# Altium schematic sheet 37. PCIe_INTERFACE 4L.SchDoc: PCIe x4 Card Connector
size 513 x 386 mm; Project: PROC154E2(001)_SK_AM69; Issue: 1.0; RevCode: E3; Page Create Date: March  8, 1995; Variant Name: Core Design; Schematic Page Number: 37; Page Number: 37; Page Size: C; Comment: MISTRAL_TITLEBLK_CSIZE_1; Page Count: 62; Schematic Page Count: 62; Name: PROC154E2 001 SK AM69; DsnPath: C:\Users\danie\Downloads\sprr466c\PROC154E3_RP\PROC154E3_SCH.DSN; SchematicName: SCHEMATIC1; PageName: 37. PCIe_INTERFACE 4L; PageSize: C; TopSchematic: True
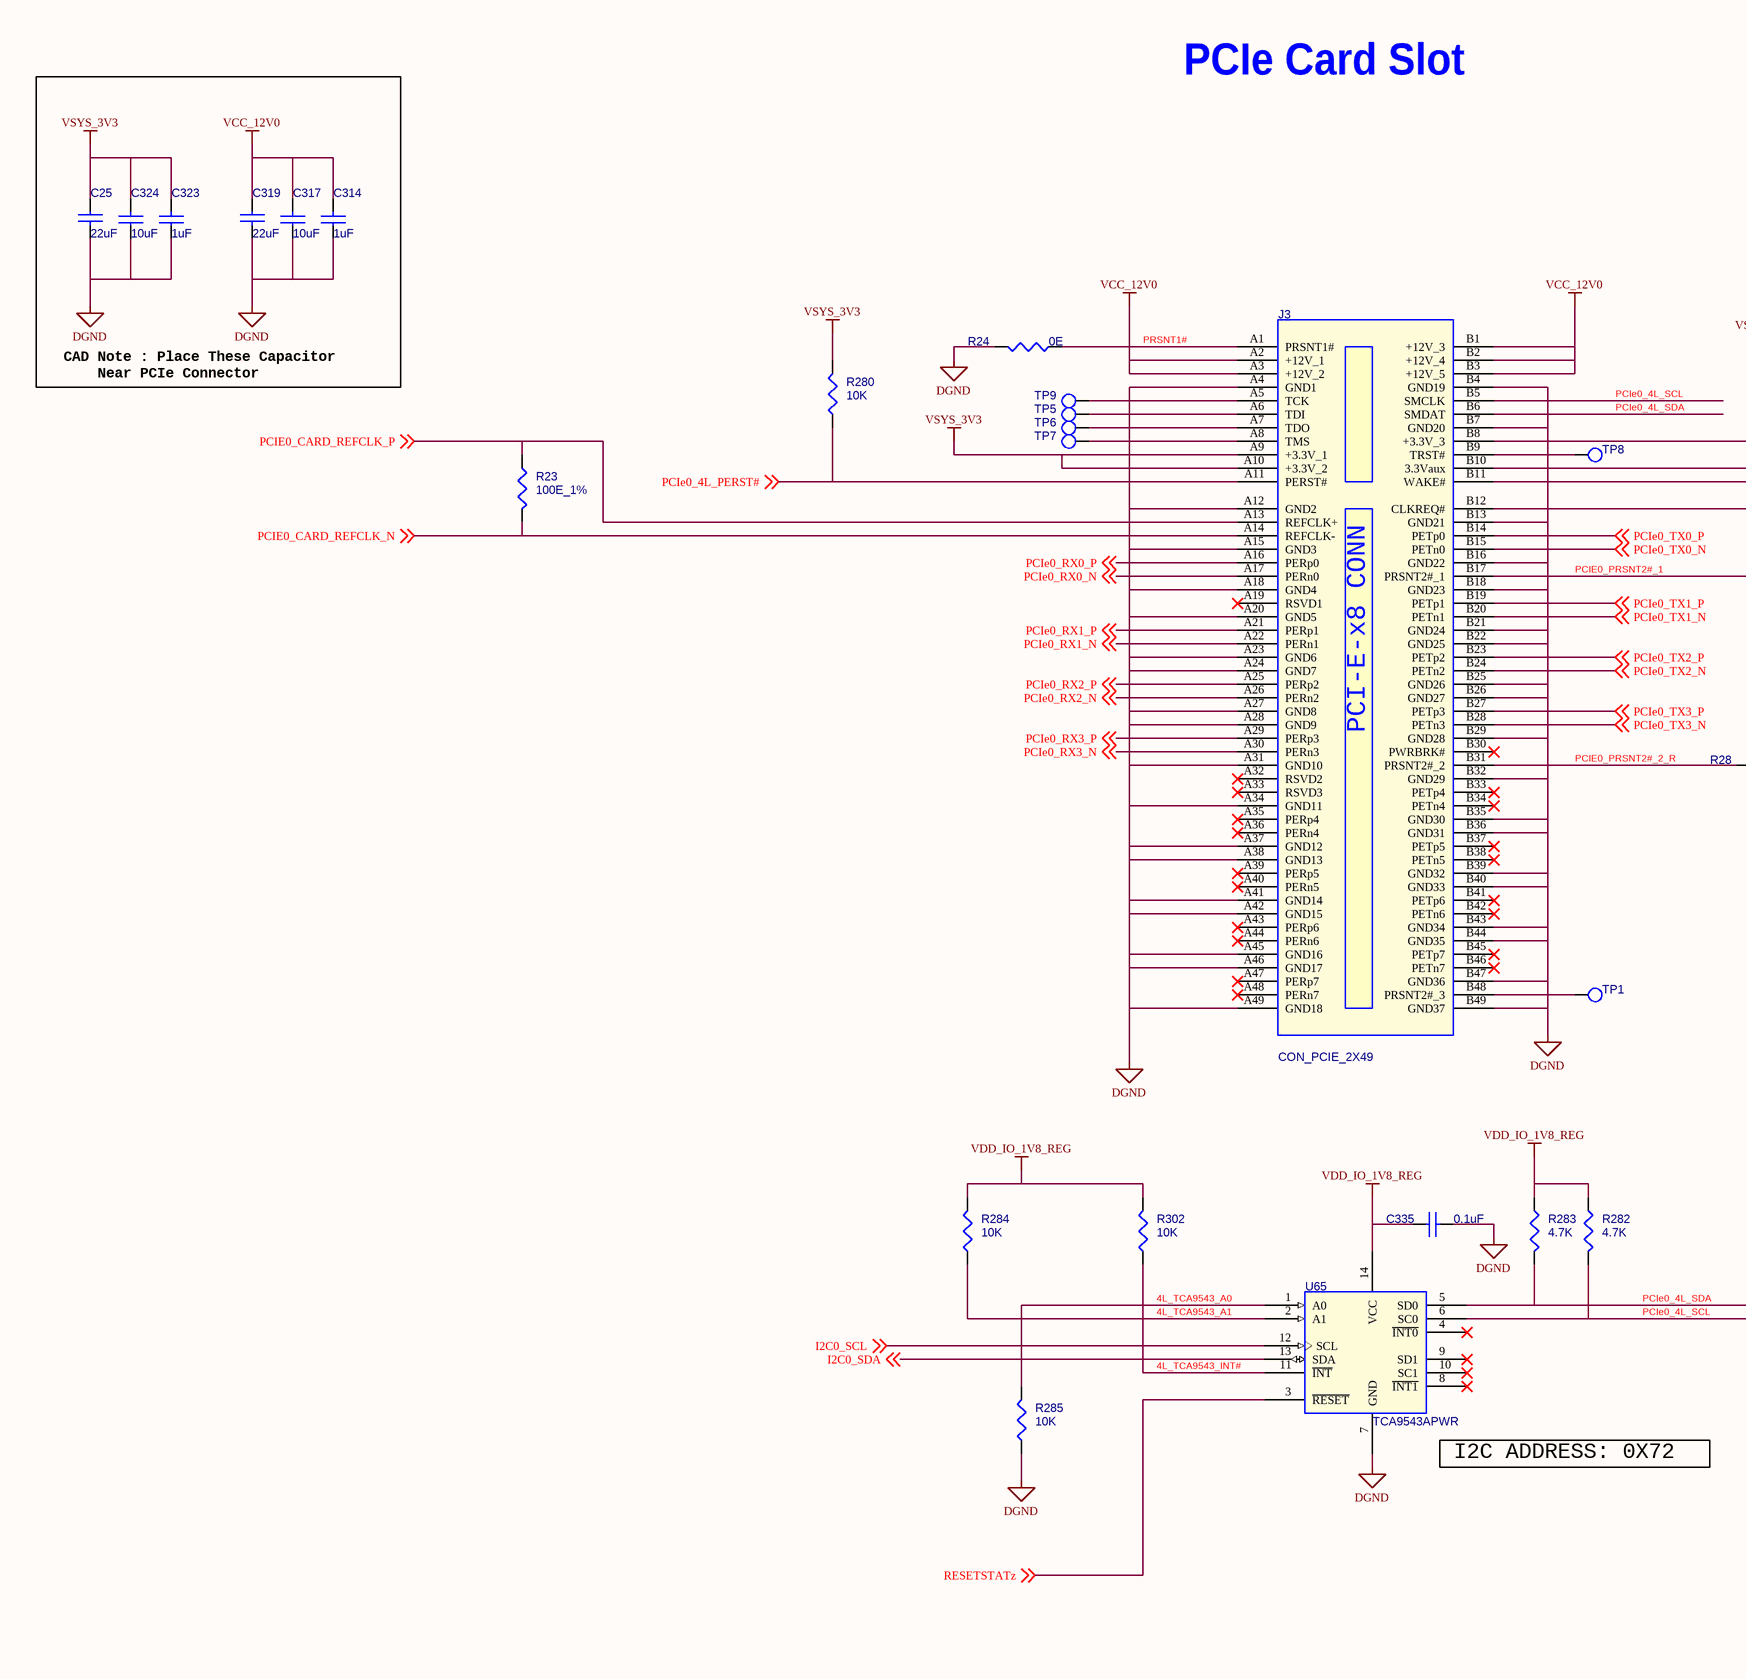
[diagram p0: 37. PCIe_INTERFACE 4L.SchDoc, left]
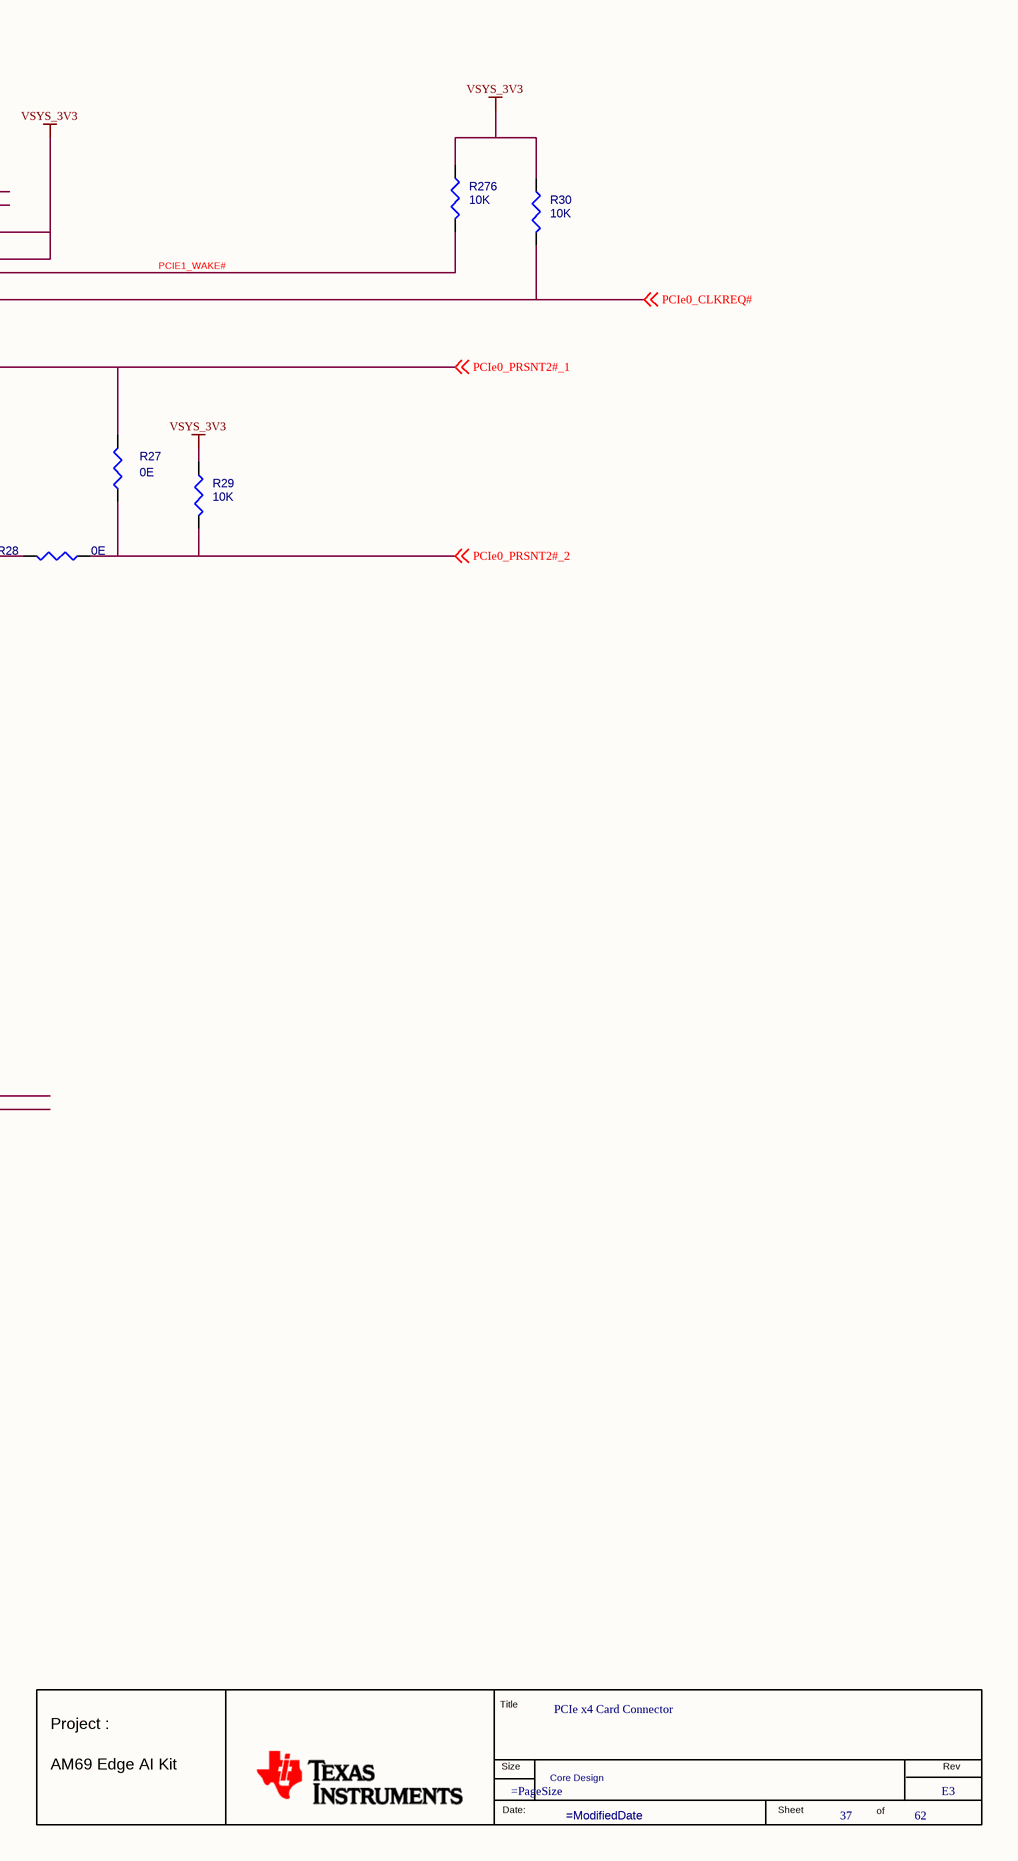
[diagram p1: 37. PCIe_INTERFACE 4L.SchDoc, right]

## Parts
*  RevCode: E3  Title: PCIe x4 Card Connector  Page Number: 37  Page Count: 62  Variant Name: Core Design  (hidden comment: MISTRAL_TITLEBLK_CSIZE_1)  (graphical)
C25  22uF  [CAP0805_1-5]
C314  1uF  [CAP0402_0-75]
C317  10uF  [CAP0603_1]
C319  22uF  [CAP0805_1-5]
C323  1uF  [CAP0402_0-75]
C324  10uF  [CAP0603_1]
C335  0.1uF  [CAP0201_0-5]
J3  CON_PCIE_2X49  [CON_PCIE98_10018783-10202_S_S_T_11-3]
R23  100E_1%  [RES0402_0-5]
R24  0E  [RES0402_0-5]
R27  0E  [RES0402_0-5]
R28  0E  [RES0402_0-5]
R29  10K  [RES0402_0-5]
R30  10K  [RES0402_0-5]
R276  10K  [RES0402_0-5]
R280  10K  [RES0201_0-5]
R282  4.7K  [RES0201_0-5]
R283  4.7K  [RES0201_0-5]
R284  10K  [RES0201_0-5]
R285  10K  [RES0201_0-5]
R302  10K  [RES0201_0-5]
TP1  TP40_SMD  [TP40_SMD]  (value not drawn)
TP5  TP40_SMD  [TP40_SMD]  (value not drawn)
TP6  TP40_SMD  [TP40_SMD]  (value not drawn)
TP7  TP40_SMD  [TP40_SMD]  (value not drawn)
TP8  TP40_SMD  [TP40_SMD]  (value not drawn)
TP9  TP40_SMD  [TP40_SMD]  (value not drawn)
U65  TCA9543APWR  [TSSOP14_25-59_205X180]

## Nets
DGND: C25.2 C314.1 C317.1 C319.2 C323.1 C324.1 C335.2 J3.A4(GND1) J3.A12(GND2) J3.A15(GND3) J3.A18(GND4) J3.A20(GND5) J3.A23(GND6) J3.A24(GND7) J3.A27(GND8) J3.A28(GND9) J3.A31(GND10) J3.A34(GND11) J3.A37(GND12) J3.A38(GND13) J3.A41(GND14) J3.A42(GND15) J3.A45(GND16) J3.A46(GND17) J3.A49(GND18) J3.B4(GND19) J3.B7(GND20) J3.B13(GND21) J3.B16(GND22) J3.B18(GND23) J3.B21(GND24) J3.B22(GND25) J3.B25(GND26) J3.B26(GND27) J3.B29(GND28) J3.B32(GND29) J3.B35(GND30) J3.B36(GND31) J3.B39(GND32) J3.B40(GND33) J3.B43(GND34) J3.B44(GND35) J3.B47(GND36) J3.B49(GND37) R24.2 R285.1 U65.7(GND)
VCC_12V0: C314.2 C317.2 C319.1 J3.A2(+12V_1) J3.A3(+12V_2) J3.B1(+12V_3) J3.B2(+12V_4) J3.B3(+12V_5)
VDD_IO_1V8_REG: C335.1 R282.1 R283.1 R284.2 R302.2 U65.14(VCC)
VSYS_3V3: C25.1 C323.2 C324.2 J3.A9(+3.3V_1) J3.A10(+3.3V_2) J3.B8(+3.3V_3) J3.B10(3.3Vaux) R29.1 R30.1 R276.1 R280.2
4L_TCA9543_A0: R285.2 U65.1(A0)
4L_TCA9543_A1: R284.1 U65.2(A1)
4L_TCA9543_INT#: R302.1 U65.11(~{INT})
I2C0_SCL: U65.12(SCL) ; off-sheet I2C0_SCL
I2C0_SDA: U65.13(SDA) ; off-sheet I2C0_SDA
PCIe0_4L_PERST#: J3.A11(PERST#) R280.1 ; off-sheet PCIe0_4L_PERST#
PCIe0_4L_SCL: J3.B5(SMCLK) R282.2 U65.6(SC0)
PCIe0_4L_SDA: J3.B6(SMDAT) R283.2 U65.5(SD0)
PCIE0_CARD_REFCLK_N: J3.A14(REFCLK-) R23.1 ; off-sheet PCIE0_CARD_REFCLK_N
PCIE0_CARD_REFCLK_P: J3.A13(REFCLK+) R23.2 ; off-sheet PCIE0_CARD_REFCLK_P
PCIe0_CLKREQ#: J3.B12(CLKREQ#) R30.2 ; off-sheet PCIe0_CLKREQ#
PCIE0_PRSNT2#_1: J3.B17(PRSNT2#_1) R27.2 ; off-sheet PCIe0_PRSNT2#_1
PCIe0_PRSNT2#_2: R27.1 R28.1 R29.2 ; off-sheet PCIe0_PRSNT2#_2
PCIE0_PRSNT2#_2_R: J3.B31(PRSNT2#_2) R28.2
PCIe0_RX0_N: J3.A17(PERn0) ; off-sheet PCIe0_RX0_N
PCIe0_RX0_P: J3.A16(PERp0) ; off-sheet PCIe0_RX0_P
PCIe0_RX1_N: J3.A22(PERn1) ; off-sheet PCIe0_RX1_N
PCIe0_RX1_P: J3.A21(PERp1) ; off-sheet PCIe0_RX1_P
PCIe0_RX2_N: J3.A26(PERn2) ; off-sheet PCIe0_RX2_N
PCIe0_RX2_P: J3.A25(PERp2) ; off-sheet PCIe0_RX2_P
PCIe0_RX3_N: J3.A30(PERn3) ; off-sheet PCIe0_RX3_N
PCIe0_RX3_P: J3.A29(PERp3) ; off-sheet PCIe0_RX3_P
PCIe0_TX0_N: J3.B15(PETn0) ; off-sheet PCIe0_TX0_N
PCIe0_TX0_P: J3.B14(PETp0) ; off-sheet PCIe0_TX0_P
PCIe0_TX1_N: J3.B20(PETn1) ; off-sheet PCIe0_TX1_N
PCIe0_TX1_P: J3.B19(PETp1) ; off-sheet PCIe0_TX1_P
PCIe0_TX2_N: J3.B24(PETn2) ; off-sheet PCIe0_TX2_N
PCIe0_TX2_P: J3.B23(PETp2) ; off-sheet PCIe0_TX2_P
PCIe0_TX3_N: J3.B28(PETn3) ; off-sheet PCIe0_TX3_N
PCIe0_TX3_P: J3.B27(PETp3) ; off-sheet PCIe0_TX3_P
PCIE1_WAKE#: J3.B11(WAKE#) R276.2
PRSNT1#: J3.A1(PRSNT1#) R24.1
RESETSTATz: U65.3(~{RESET}) ; off-sheet RESETSTATz
NetJ3_A5: J3.A5(TCK) TP9.1(TP)
NetJ3_A6: J3.A6(TDI) TP5.1(TP)
NetJ3_A7: J3.A7(TDO) TP6.1(TP)
NetJ3_A8: J3.A8(TMS) TP7.1(TP)
NetJ3_B9: J3.B9(TRST#) TP8.1(TP)
NetJ3_B48: J3.B48(PRSNT2#_3) TP1.1(TP)

Not connected (* = marked no-connect by the designer): J3 A19(RSVD1)* A32(RSVD2)* A33(RSVD3)* A35(PERp4)* A36(PERn4)* A39(PERp5)* A40(PERn5)* A43(PERp6)* A44(PERn6)* A47(PERp7)* A48(PERn7)* B30(PWRBRK#)* B33(PETp4)* B34(PETn4)* B37(PETp5)* B38(PETn5)* B41(PETp6)* B42(PETn6)* B45(PETp7)* B46(PETn7)*; U65 4(~{INT0})* 8(~{INT1})* 9(SD1)* 10(SC1)*

## Notes on the sheet
- PCIe Card Slot
- CAD Note : Place These Capacitor
  Near PCIe Connector
- (near U65) I2C ADDRESS: 0X72
- (in symbol CON98_PCI_1) PCI-E-x8 CONN
- (in symbol MISTRAL_TITLEBLK_CSIZE_1) Title; Project :; Size; Rev; AM69 Edge AI Kit; Date:; Sheet; of

## Library data of the parts
* = MISTRAL_TITLEBLK_CSIZE_1: Issue: 1.0; Project: PROC154E2(001)_SK_AM69; Name: PROC154E2 001 SK AM69; Page Create Date: March  8, 1995; Page Size: =PageSize; Page Modify Date: =ModifiedDate; Schematic Page Count: 62; Schematic Page Number: 37
C25 = CAP_Dup1: CAP CERAMIC 22uF 25V 20% X5R 0805; Part Reference: C25; Part_type: CAPACITORS\CERAMIC; Mfr_part_number: GRM21BR61E226ME44K; Mfr_name: MURATA; Mistral Part No: 120013120018-R; Custom_Duty: 15%; Customs_HS_Code: 85322990; Wattage: NA; Project: TI_J7SVB_PCIE_ADD-ON-CARD; Value: 22uF; PCB Footprint: CAP0805_1-5; MECHANICAL 3D STEP FILE: CAP0805_1-5; Chkd/date: MANIRAJA/110718; Crtd /date: ALVY/110718; Datasheet: Y:\MIS_DATABASE\DATASHEETS\CAPACITORS\GRM21BR61E226ME44K.PDF; Temperature: -55°C+85°C; Weight: 9.5mg; Height: 1.45MM; Library Ref: CAP; Distributor_part_number: 490-14661-1-ND; Distributor_name: DIGIKEY; Package: 0805; Voltage: 25V; Tolerance: 20%; Footprint Ref: CAP0805_1-5; Library Path: Y:\MIS_DATABASE\Library\ALTIUM_TOOL\SCHEMATICS_PARTS\MS_DISCRETE_Library.schlib; Footprint Path: Y:\MIS_DATABASE\Library\ALTIUM_TOOL\PCB_FOOTPRINTS\Altium_Footprint_Lib.PcbLib
C314 = CAP_Dup1: CAP CERAMIC 1uF 25V 20% X5R 0402; Part Reference: C314; Mistral Part No: 120018020008-R; Mfr_name: TAIYO YUDEN; Mfr_part_number: TMK105BJ105MV-F; Part_type: CAPACITORS\CERAMIC; Project: TI_SVB_MAXWELL_SPM; Wattage: NA; Customs_HS_Code: 85322990; Custom_Duty: 15%; Value: 1uF; PCB Footprint: CAP0402_0-75; Tolerance: 20%; Voltage: 25V; Package: 0402; Distributor_name: DIGIKEY; Distributor_part_number: 587-3245-1-ND; Library Ref: CAP; Height: 0.55MM; Weight: 0.65mg; Temperature: -55°C+85°C; Datasheet: Y:\MIS_DATABASE\DATASHEETS\CAPACITORS\TMK105BJ105MV-F.PDF; Crtd /date: ALVY/140218; Chkd/date: MANIRAJA/160218; MECHANICAL 3D STEP FILE: CAP0402_0-75; Footprint Ref: CAP0402_0-75; Library Path: Y:\MIS_DATABASE\Library\ALTIUM_TOOL\SCHEMATICS_PARTS\MS_DISCRETE_Library.schlib; Footprint Path: Y:\MIS_DATABASE\Library\ALTIUM_TOOL\PCB_FOOTPRINTS\Altium_Footprint_Lib.PcbLib
C317 = CAP_Dup1: CAP CERAMIC 10uF 25V 20% X5R 0603; Part Reference: C317; Part_type: CAPACITORS\CERAMIC; Mfr_part_number: C1608X5R1E106M080AC; Mfr_name: TDK CORPORATION; Mistral Part No: 120013060015-R; Custom_Duty: 15%; Customs_HS_Code: 85322990; Wattage: NA; Project: DTRM; Value: 10uF; Footprint Path: Y:\MIS_DATABASE\Library\ALTIUM_TOOL\PCB_FOOTPRINTS\Altium_Footprint_Lib.PcbLib; Library Path: Y:\MIS_DATABASE\Library\ALTIUM_TOOL\SCHEMATICS_PARTS\MS_DISCRETE_Library.schlib; Footprint Ref: CAP0603_1; PCB Footprint: CAP0603_1; MECHANICAL 3D STEP FILE: CAP0603_1; Chkd/date: VASANTHA/170217; Crtd /date: LOGU/110613; Datasheet: Y:\MIS_DATABASE\DATASHEETS\CAPACITORS\TDK_C-SER-JUL17.PDF; Temperature: -55°C+85°C; Weight: 2mg; Height: 1.00MM; Library Ref: CAP; Distributor_part_number: 445-9015-1-ND; Distributor_name: DIGIKEY; Package: 0603; Voltage: 25V; Tolerance: 20%
C319 = CAP_Dup1: CAP CERAMIC 22uF 25V 20% X5R 0805; Part Reference: C319; Part_type: CAPACITORS\CERAMIC; Mfr_part_number: GRM21BR61E226ME44K; Mfr_name: MURATA; Mistral Part No: 120013120018-R; Custom_Duty: 15%; Customs_HS_Code: 85322990; Wattage: NA; Project: TI_J7SVB_PCIE_ADD-ON-CARD; Value: 22uF; PCB Footprint: CAP0805_1-5; Footprint Path: Y:\MIS_DATABASE\Library\ALTIUM_TOOL\PCB_FOOTPRINTS\Altium_Footprint_Lib.PcbLib; Library Path: Y:\MIS_DATABASE\Library\ALTIUM_TOOL\SCHEMATICS_PARTS\MS_DISCRETE_Library.schlib; Footprint Ref: CAP0805_1-5; MECHANICAL 3D STEP FILE: CAP0805_1-5; Chkd/date: MANIRAJA/110718; Crtd /date: ALVY/110718; Datasheet: Y:\MIS_DATABASE\DATASHEETS\CAPACITORS\GRM21BR61E226ME44K.PDF; Temperature: -55°C+85°C; Weight: 9.5mg; Height: 1.45MM; Library Ref: CAP; Distributor_part_number: 490-14661-1-ND; Distributor_name: DIGIKEY; Package: 0805; Voltage: 25V; Tolerance: 20%
C323 = CAP_Dup1: CAP CERAMIC 1uF 25V 20% X5R 0402; Part Reference: C323; Part_type: CAPACITORS\CERAMIC; Mfr_part_number: TMK105BJ105MV-F; Mfr_name: TAIYO YUDEN; Mistral Part No: 120018020008-R; Custom_Duty: 15%; Customs_HS_Code: 85322990; Wattage: NA; Project: TI_SVB_MAXWELL_SPM; Value: 1uF; PCB Footprint: CAP0402_0-75; Footprint Path: Y:\MIS_DATABASE\Library\ALTIUM_TOOL\PCB_FOOTPRINTS\Altium_Footprint_Lib.PcbLib; Library Path: Y:\MIS_DATABASE\Library\ALTIUM_TOOL\SCHEMATICS_PARTS\MS_DISCRETE_Library.schlib; Footprint Ref: CAP0402_0-75; MECHANICAL 3D STEP FILE: CAP0402_0-75; Chkd/date: MANIRAJA/160218; Crtd /date: ALVY/140218; Datasheet: Y:\MIS_DATABASE\DATASHEETS\CAPACITORS\TMK105BJ105MV-F.PDF; Temperature: -55°C+85°C; Weight: 0.65mg; Height: 0.55MM; Library Ref: CAP; Distributor_part_number: 587-3245-1-ND; Distributor_name: DIGIKEY; Package: 0402; Voltage: 25V; Tolerance: 20%
C324 = CAP_Dup1: CAP CERAMIC 10uF 25V 20% X5R 0603; Part Reference: C324; Part_type: CAPACITORS\CERAMIC; Mfr_part_number: C1608X5R1E106M080AC; Mfr_name: TDK CORPORATION; Mistral Part No: 120013060015-R; Custom_Duty: 15%; Customs_HS_Code: 85322990; Wattage: NA; Project: DTRM; Value: 10uF; PCB Footprint: CAP0603_1; MECHANICAL 3D STEP FILE: CAP0603_1; Chkd/date: VASANTHA/170217; Crtd /date: LOGU/110613; Datasheet: Y:\MIS_DATABASE\DATASHEETS\CAPACITORS\TDK-JAN13.PDF; Temperature: -55°C+85°C; Weight: 2mg; Height: 1.00MM; Library Ref: CAP; Distributor_part_number: 445-9015-1-ND; Distributor_name: DIGIKEY; Package: 0603; Voltage: 25V; Tolerance: 20%
C335 = CAP_Dup1: CAP CERAMIC 0.1uF 16V 10% X7S AUTO 0201; Part Reference: C335; Part_type: CAPACITORS\CERAMIC; Mfr_part_number: GRT033C71C104KE01D; Mfr_name: MURATA; Mistral Part No: 120021030007-R; Custom_Duty: 15%; Customs_HS_Code: 85322990; Wattage: NA; Project: J7ES_SK_BRD; Value: 0.1uF; PCB Footprint: CAP0201_0-5; MECHANICAL 3D STEP FILE: CAP0201_0-5; Chkd/date: MANIRAJA/110321; Crtd /date: ALVY/110321; Datasheet: Y:\MIS_DATABASE\DATASHEETS\CAPACITORS\GRT033C71C104KE01.PDF; Temperature: -55°C+125°C; Weight: 330mg; Height: 0.33MM; Distributor_part_number: 490-GRT033C71C104KE01DTR-ND; Distributor_name: DIGIKEY; Package: 0201; Voltage: 16V; Tolerance: 10%
J3 = CON98_PCI_1: CON PCI EXPRESS 2X49 1.00MM PITCH FEMALE ST TH; Part Reference: J3; Part_type: CONNECTOR\PCI; Mfr_part_number: 10018783-10202TLF; Mfr_name: FCI; Mistral Part No: 150018100002-R; Custom_Duty: 24%; Customs_HS_Code: 85369090; Wattage: NA; Project: DARE_WBDAC_BACKPLANE; Value: CON_PCIE_2X49; Footprint Path: Y:\MIS_DATABASE\Library\ALTIUM_TOOL\PCB_FOOTPRINTS\Altium_Footprint_Lib.PcbLib; Library Path: Y:\MIS_DATABASE\Library\ALTIUM_TOOL\SCHEMATICS_PARTS\MS_CONNECTOR_Library.schlib; MECHANICAL 3D STEP FILE: CON_PCIE98_10018783-10202_S_S_T_11-3; Chkd/date: MANIRAJA/011018; Crtd /date: ALVY/011018; Datasheet: Y:\MIS_DATABASE\DATASHEETS\CONNECTORS\10018783-XX.PDF; Temperature: -55°C+85°C; Weight: NA; Height: 11.25MM; Library Ref: CON98_PCI; Distributor_part_number: 609-1979-ND; Distributor_name: DIGIKEY; Package: THRU-HOLE; Voltage: NA; Tolerance: NA; Footprint Ref: CON_PCIE98_10018783-10202_S_S_T_11-3; PCB Footprint: CON_PCIE98_10018783-10202_S_S_T_11-3
R23 = RESISTOR_Dup2: RES 100E 1/10W 1% 0402; Part Reference: R23; Part_type: RESISTORS\FIXED; Mfr_part_number: ERJ-2RKF1000X; Mfr_name: PANASONIC-ECG; Mistral Part No: 110018020036-R; Custom_Duty: 15%; Customs_HS_Code: 85332119; Voltage: NA; Project: CYPHY_FVB; Value: 100E_1%; Footprint Path: Y:\MIS_DATABASE\Library\ALTIUM_TOOL\PCB_FOOTPRINTS\Altium_Footprint_Lib.PcbLib; Library Path: Y:\MIS_DATABASE\Library\ALTIUM_TOOL\SCHEMATICS_PARTS\MS_DISCRETE_Library.schlib; Footprint Ref: RES0402_0-5; Library Ref: RESISTOR; Chkd/date: MANIRAJA/130617; Crtd /date: JEBRAN/040715; Datasheet: Y:\MIS_DATABASE\DATASHEETS\RESISTORS\PAN-ERJSER_NOV17.PDF; Temperature: -55°C+155°C; Weight: 0.8mg; Height: 0.40MM; Distributor_part_number: P100LCT-ND; Distributor_name: DIGIKEY; Package: 0402; Wattage: 1/10W; Tolerance: 1%; MECHANICAL 3D STEP FILE: RES0402_0-5; PCB Footprint: RES0402_0-5
R24 = RESISTOR_Dup2: RES 0E 1/10W JUMPER 0402; Part Reference: R24; Part_type: RESISTORS\FIXED; Mfr_part_number: ERJ-2GE0R00X; Mfr_name: PANASONIC-ECG; Mistral Part No: 110014100008-R; Custom_Duty: 15%; Customs_HS_Code: 85332119; Voltage: NA; Project: AEGIS POM; IBISSP_MODLES: VALUE REPEATING 2 TIME; Value: 0E; PCB Footprint: RES0402_0-5; MECHANICAL 3D STEP FILE: RES0402_0-5; Chkd/date: VASANTHA/061216; Crtd /date: NAVEED/201014; Datasheet: Y:\MIS_DATABASE\DATASHEETS\RESISTORS\PAN-ERJSER_NOV17.PDF; Temperature: -55°C+155°C; Weight: 0.8mg; Height: 0.40MM; Distributor_part_number: P0.0JCT-ND; Distributor_name: DIGIKEY; Package: 0402; Wattage: 1/10W; Tolerance: NA; Library Ref: RESISTOR; Footprint Ref: RES0402_0-5; Library Path: Y:\MIS_DATABASE\Library\ALTIUM_TOOL\SCHEMATICS_PARTS\MS_DISCRETE_Library.schlib; Footprint Path: Y:\MIS_DATABASE\Library\ALTIUM_TOOL\PCB_FOOTPRINTS\Altium_Footprint_Lib.PcbLib
R27 = RESISTOR_Dup2: RES 0E 1/10W JUMPER 0402; Part Reference: R27; Mistral Part No: 110014100008-R; Mfr_name: PANASONIC-ECG; Mfr_part_number: ERJ-2GE0R00X; Part_type: RESISTORS\FIXED; IBISSP_MODLES: VALUE REPEATING 2 TIME; Project: AEGIS POM; Tolerance: NA; Customs_HS_Code: 85332119; Custom_Duty: 15%; Value: 0E; PCB Footprint: RES0402_0-5; Footprint Path: Y:\MIS_DATABASE\Library\ALTIUM_TOOL\PCB_FOOTPRINTS\Altium_Footprint_Lib.PcbLib; Library Path: Y:\MIS_DATABASE\Library\ALTIUM_TOOL\SCHEMATICS_PARTS\MS_DISCRETE_Library.schlib; Footprint Ref: RES0402_0-5; Library Ref: RESISTOR; Voltage: NA; Wattage: 1/10W; Package: 0402; Distributor_name: DIGIKEY; Distributor_part_number: P0.0JCT-ND; Height: 0.40MM; Weight: 0.8mg; Temperature: -55°C+155°C; Datasheet: Y:\MIS_DATABASE\DATASHEETS\RESISTORS\PAN-ERJSER_NOV17.PDF; Crtd /date: NAVEED/201014; Chkd/date: VASANTHA/061216; MECHANICAL 3D STEP FILE: RES0402_0-5
R28 = RESISTOR_Dup2: RES 0E 1/10W JUMPER 0402; Part Reference: R28; Mistral Part No: 110014100008-R; Mfr_name: PANASONIC-ECG; Mfr_part_number: ERJ-2GE0R00X; Part_type: RESISTORS\FIXED; IBISSP_MODLES: VALUE REPEATING 2 TIME; Project: AEGIS POM; Tolerance: NA; Customs_HS_Code: 85332119; Custom_Duty: 15%; Value: 0E; PCB Footprint: RES0402_0-5; Footprint Path: Y:\MIS_DATABASE\Library\ALTIUM_TOOL\PCB_FOOTPRINTS\Altium_Footprint_Lib.PcbLib; Library Path: Y:\MIS_DATABASE\Library\ALTIUM_TOOL\SCHEMATICS_PARTS\MS_DISCRETE_Library.schlib; Footprint Ref: RES0402_0-5; Library Ref: RESISTOR; Voltage: NA; Wattage: 1/10W; Package: 0402; Distributor_name: DIGIKEY; Distributor_part_number: P0.0JCT-ND; Height: 0.40MM; Weight: 0.8mg; Temperature: -55°C+155°C; Datasheet: Y:\MIS_DATABASE\DATASHEETS\RESISTORS\PAN-ERJSER_NOV17.PDF; Crtd /date: NAVEED/201014; Chkd/date: VASANTHA/061216; MECHANICAL 3D STEP FILE: RES0402_0-5
R29 = RESISTOR_Dup2: RES 10K 1/16W 5% 0402; Part Reference: R29; Mistral Part No: 110011060021-R; Mfr_name: VISHAY; Mfr_part_number: CRCW040210K0JNEA; Part_type: RESISTORS\FIXED; Project: FLR PSPU; Voltage: NA; Customs_HS_Code: 85332119; Custom_Duty: 15%; Value: 10K; PCB Footprint: RES0402_0-5; Tolerance: 5%; Wattage: 1/16W; Package: 0402; Distributor_name: NA; Distributor_part_number: NA; Library Ref: RESISTOR; Footprint Ref: RES0402_0-5; Height: 0.40MM; Weight: 0.65mg; Temperature: -55°C+155°C; Datasheet: Y:\MIS_DATABASE\DATASHEETS\RESISTORS\CRCW0603.PDF; Crtd /date: BAVISH/060611; Chkd/date: MANIRAJA/120617; MECHANICAL 3D STEP FILE: RES0402_0-5; Library Path: Y:\MIS_DATABASE\Library\ALTIUM_TOOL\SCHEMATICS_PARTS\MS_DISCRETE_Library.schlib; Footprint Path: Y:\MIS_DATABASE\Library\ALTIUM_TOOL\PCB_FOOTPRINTS\Altium_Footprint_Lib.PcbLib
R30 = RESISTOR_Dup2: RES 10K 1/16W 5% 0402; Part Reference: R30; Part_type: RESISTORS\FIXED; Mfr_part_number: CRCW040210K0JNEA; Mfr_name: VISHAY; Mistral Part No: 110011060021-R; Custom_Duty: 15%; Customs_HS_Code: 85332119; Voltage: NA; Project: FLR PSPU; Value: 10K; PCB Footprint: RES0402_0-5; Footprint Path: Y:\MIS_DATABASE\Library\ALTIUM_TOOL\PCB_FOOTPRINTS\Altium_Footprint_Lib.PcbLib; Library Path: Y:\MIS_DATABASE\Library\ALTIUM_TOOL\SCHEMATICS_PARTS\MS_DISCRETE_Library.schlib; MECHANICAL 3D STEP FILE: RES0402_0-5; Chkd/date: MANIRAJA/120617; Crtd /date: BAVISH/060611; Datasheet: Y:\MIS_DATABASE\DATASHEETS\RESISTORS\CRCW0603.PDF; Temperature: -55°C+155°C; Weight: 0.65mg; Height: 0.40MM; Footprint Ref: RES0402_0-5; Library Ref: RESISTOR; Distributor_part_number: NA; Distributor_name: NA; Package: 0402; Wattage: 1/16W; Tolerance: 5%
R276 = RESISTOR_Dup2: RES 10K 1/16W 5% 0402; Part Reference: R276; Mistral Part No: 110011060021-R; Mfr_name: VISHAY; Mfr_part_number: CRCW040210K0JNEA; Part_type: RESISTORS\FIXED; Project: FLR PSPU; Voltage: NA; Customs_HS_Code: 85332119; Custom_Duty: 15%; Value: 10K; PCB Footprint: RES0402_0-5; Tolerance: 5%; Wattage: 1/16W; Package: 0402; Distributor_name: NA; Distributor_part_number: NA; Library Ref: RESISTOR; Footprint Ref: RES0402_0-5; Height: 0.40MM; Weight: 0.65mg; Temperature: -55°C+155°C; Datasheet: Y:\MIS_DATABASE\DATASHEETS\RESISTORS\CRCW0603.PDF; Crtd /date: BAVISH/060611; Chkd/date: MANIRAJA/120617; MECHANICAL 3D STEP FILE: RES0402_0-5; Library Path: Y:\MIS_DATABASE\Library\ALTIUM_TOOL\SCHEMATICS_PARTS\MS_DISCRETE_Library.schlib; Footprint Path: Y:\MIS_DATABASE\Library\ALTIUM_TOOL\PCB_FOOTPRINTS\Altium_Footprint_Lib.PcbLib
R280 = RESISTOR_Dup2: RES 10K 1/20W 5% 0201; Part Reference: R280; Part_type: RESISTORS\FIXED; Mfr_part_number: RC0201JR-0710KL; Mfr_name: YAGEO AMERICA; Mistral Part No: 110010070051-R; Custom_Duty: 15%; Customs_HS_Code: 85332119; Voltage: NA; Project: GOLDEN-I LITE; Value: 10K; MECHANICAL 3D STEP FILE: RES0201_0-5; Chkd/date: MANIRAJA/050517; Crtd /date: MANIRAJA/050517; Datasheet: Y:\MIS_DATABASE\DATASHEETS\RESISTORS\RCXXXXL-SER_MAR18.PDF; Temperature: -55°C+125°C; Weight: 0.17mg; Height: 0.26MM; Distributor_part_number: 311-10KNCT-ND; Distributor_name: DIGIKEY; Package: 0201; Wattage: 1/20W; Tolerance: 5%; Library Ref: RESISTOR; Footprint Ref: RES0201_0-5; Library Path: Y:\MIS_DATABASE\Library\ALTIUM_TOOL\SCHEMATICS_PARTS\MS_DISCRETE_Library.schlib; Footprint Path: Y:\MIS_DATABASE\Library\ALTIUM_TOOL\PCB_FOOTPRINTS\Altium_Footprint_Lib.PcbLib; PCB Footprint: RES0201_0-5
R282 = RESISTOR_Dup2: RES 4.7K 1/20W 5% 0201; Part Reference: R282; Mistral Part No: 110010070061-R; Mfr_name: PANASONIC-ECG; Mfr_part_number: ERJ-1GNJ472C; Part_type: RESISTORS\FIXED; Project: CUSTOM DCA1000; Voltage: NA; Customs_HS_Code: 85332119; Custom_Duty: 15%; Value: 4.7K; PCB Footprint: RES0201_0-5; Footprint Path: Y:\MIS_DATABASE\Library\ALTIUM_TOOL\PCB_FOOTPRINTS\Altium_Footprint_Lib.PcbLib; Library Path: Y:\MIS_DATABASE\Library\ALTIUM_TOOL\SCHEMATICS_PARTS\MS_DISCRETE_Library.schlib; MECHANICAL 3D STEP FILE: RES0201_0-5; Footprint Ref: RES0201_0-5; Tolerance: 5%; Wattage: 1/20W; Package: 0201; Distributor_name: DIGIKEY; Distributor_part_number: P4.7AECT-ND; Library Ref: RESISTOR; Height: 0.26MM; Weight: 0.15mg; Temperature: -55°C+125°C; Datasheet: Y:\MIS_DATABASE\DATASHEETS\RESISTORS\PAN-ERJSER_NOV17.PDF; Crtd /date: ALVY/170420; Chkd/date: MANIRAJA/170420
R283 = RESISTOR_Dup2: RES 4.7K 1/20W 5% 0201; Part Reference: R283; Mistral Part No: 110010070061-R; Mfr_name: PANASONIC-ECG; Mfr_part_number: ERJ-1GNJ472C; Part_type: RESISTORS\FIXED; Project: CUSTOM DCA1000; Voltage: NA; Customs_HS_Code: 85332119; Custom_Duty: 15%; Value: 4.7K; PCB Footprint: RES0201_0-5; Footprint Path: Y:\MIS_DATABASE\Library\ALTIUM_TOOL\PCB_FOOTPRINTS\Altium_Footprint_Lib.PcbLib; Library Path: Y:\MIS_DATABASE\Library\ALTIUM_TOOL\SCHEMATICS_PARTS\MS_DISCRETE_Library.schlib; MECHANICAL 3D STEP FILE: RES0201_0-5; Footprint Ref: RES0201_0-5; Tolerance: 5%; Wattage: 1/20W; Package: 0201; Distributor_name: DIGIKEY; Distributor_part_number: P4.7AECT-ND; Library Ref: RESISTOR; Height: 0.26MM; Weight: 0.15mg; Temperature: -55°C+125°C; Datasheet: Y:\MIS_DATABASE\DATASHEETS\RESISTORS\PAN-ERJSER_NOV17.PDF; Crtd /date: ALVY/170420; Chkd/date: MANIRAJA/170420
R284 = RESISTOR_Dup2: RES 10K 1/20W 5% 0201; Part Reference: R284; Mistral Part No: 110010070051-R; Mfr_name: YAGEO AMERICA; Mfr_part_number: RC0201JR-0710KL; Part_type: RESISTORS\FIXED; Project: GOLDEN-I LITE; Voltage: NA; Customs_HS_Code: 85332119; Custom_Duty: 15%; Value: 10K; PCB Footprint: RES0201_0-5; Footprint Path: Y:\MIS_DATABASE\Library\ALTIUM_TOOL\PCB_FOOTPRINTS\Altium_Footprint_Lib.PcbLib; Library Path: Y:\MIS_DATABASE\Library\ALTIUM_TOOL\SCHEMATICS_PARTS\MS_DISCRETE_Library.schlib; Footprint Ref: RES0201_0-5; Library Ref: RESISTOR; Tolerance: 5%; Wattage: 1/20W; Package: 0201; Distributor_name: DIGIKEY; Distributor_part_number: 311-10KNCT-ND; Height: 0.26MM; Weight: 0.17mg; Temperature: -55°C+125°C; Datasheet: Y:\MIS_DATABASE\DATASHEETS\RESISTORS\RCXXXXL-SER_MAR18.PDF; Crtd /date: MANIRAJA/050517; Chkd/date: MANIRAJA/050517; MECHANICAL 3D STEP FILE: RES0201_0-5
R285 = RESISTOR_Dup2: RES 10K 1/20W 5% 0201; Part Reference: R285; Part_type: RESISTORS\FIXED; Mfr_part_number: RC0201JR-0710KL; Mfr_name: YAGEO AMERICA; Mistral Part No: 110010070051-R; Custom_Duty: 15%; Customs_HS_Code: 85332119; Voltage: NA; Project: GOLDEN-I LITE; Value: 10K; PCB Footprint: RES0201_0-5; MECHANICAL 3D STEP FILE: RES0201_0-5; Chkd/date: MANIRAJA/050517; Crtd /date: MANIRAJA/050517; Datasheet: Y:\MIS_DATABASE\DATASHEETS\RESISTORS\RCXXXXL-SER_MAR18.PDF; Temperature: -55°C+125°C; Weight: 0.17mg; Height: 0.26MM; Distributor_part_number: 311-10KNCT-ND; Distributor_name: DIGIKEY; Package: 0201; Wattage: 1/20W; Tolerance: 5%; Library Ref: RESISTOR; Footprint Ref: RES0201_0-5; Library Path: Y:\MIS_DATABASE\Library\ALTIUM_TOOL\SCHEMATICS_PARTS\MS_DISCRETE_Library.schlib; Footprint Path: Y:\MIS_DATABASE\Library\ALTIUM_TOOL\PCB_FOOTPRINTS\Altium_Footprint_Lib.PcbLib
R302 = RESISTOR_Dup2: RES 10K 1/20W 5% 0201; Part Reference: R302; Part_type: RESISTORS\FIXED; Mfr_part_number: RC0201JR-0710KL; Mfr_name: YAGEO AMERICA; Mistral Part No: 110010070051-R; Custom_Duty: 15%; Customs_HS_Code: 85332119; Voltage: NA; Project: GOLDEN-I LITE; Value: 10K; PCB Footprint: RES0201_0-5; MECHANICAL 3D STEP FILE: RES0201_0-5; Chkd/date: MANIRAJA/050517; Crtd /date: MANIRAJA/050517; Datasheet: Y:\MIS_DATABASE\DATASHEETS\RESISTORS\RCXXXXL-SER_MAR18.PDF; Temperature: -55°C+125°C; Weight: 0.17mg; Height: 0.26MM; Distributor_part_number: 311-10KNCT-ND; Distributor_name: DIGIKEY; Package: 0201; Wattage: 1/20W; Tolerance: 5%; Library Ref: RESISTOR; Footprint Ref: RES0201_0-5; Library Path: Y:\MIS_DATABASE\Library\ALTIUM_TOOL\SCHEMATICS_PARTS\MS_DISCRETE_Library.schlib; Footprint Path: Y:\MIS_DATABASE\Library\ALTIUM_TOOL\PCB_FOOTPRINTS\Altium_Footprint_Lib.PcbLib
TP1 = TESTPOINT_Dup1: TESTPOINT CIR 40 SMD; Part Reference: TP1; Mistral Part No: 130009030933; Mfr_name: LOCAL; MECHANICAL 3D STEP FILE: NA; Project: RAINIER-3; Value: TP40_SMD; RoHS: NA; Footprint Ref: TP40_SMD; Library Ref: TESTPOINT; Datasheet: NA; Temperature: NA; Weight: NA; Wattage: NA; Voltage: NA; Tolerance: NA; Mfr_part_number: TP40_SMD; Part_type: TESTPOINT; Package: SMD; Distributor_name: NA; Distributor_part_number: NA; Height: NA; Crtd /date: MAZHAR/190505; Chkd/date: MAZHAR/190505; Library Path: Y:\MIS_DATABASE\Library\ALTIUM_TOOL\SCHEMATICS_PARTS\MS_DISCRETE_Library.schlib; Footprint Path: Y:\MIS_DATABASE\Library\ALTIUM_TOOL\PCB_FOOTPRINTS\Altium_Footprint_Lib.PcbLib; PCB Footprint: TP40_SMD
TP5 = TESTPOINT_Dup1: TESTPOINT CIR 40 SMD; Part Reference: TP5; Mfr_name: LOCAL; Mistral Part No: 130009030933; Project: RAINIER-3; Tolerance: NA; Value: TP40_SMD; PCB Footprint: TP40_SMD; Footprint Path: Y:\MIS_DATABASE\Library\ALTIUM_TOOL\PCB_FOOTPRINTS\Altium_Footprint_Lib.PcbLib; Library Path: Y:\MIS_DATABASE\Library\ALTIUM_TOOL\SCHEMATICS_PARTS\MS_DISCRETE_Library.schlib; Chkd/date: MAZHAR/190505; Crtd /date: MAZHAR/190505; Height: NA; Distributor_part_number: NA; Distributor_name: NA; Package: SMD; Part_type: TESTPOINT; Mfr_part_number: TP40_SMD; Voltage: NA; Wattage: NA; Weight: NA; Temperature: NA; Datasheet: NA; MECHANICAL 3D STEP FILE: NA; Library Ref: TESTPOINT; Footprint Ref: TP40_SMD; RoHS: NA
TP6 = TESTPOINT_Dup1: TESTPOINT CIR 40 SMD; Part Reference: TP6; Mfr_name: LOCAL; Mistral Part No: 130009030933; Project: RAINIER-3; Tolerance: NA; Value: TP40_SMD; PCB Footprint: TP40_SMD; Footprint Path: Y:\MIS_DATABASE\Library\ALTIUM_TOOL\PCB_FOOTPRINTS\Altium_Footprint_Lib.PcbLib; Library Path: Y:\MIS_DATABASE\Library\ALTIUM_TOOL\SCHEMATICS_PARTS\MS_DISCRETE_Library.schlib; Chkd/date: MAZHAR/190505; Crtd /date: MAZHAR/190505; Height: NA; Distributor_part_number: NA; Distributor_name: NA; Package: SMD; Part_type: TESTPOINT; Mfr_part_number: TP40_SMD; Voltage: NA; Wattage: NA; Weight: NA; Temperature: NA; Datasheet: NA; MECHANICAL 3D STEP FILE: NA; Library Ref: TESTPOINT; Footprint Ref: TP40_SMD; RoHS: NA
TP7 = TESTPOINT_Dup1: TESTPOINT CIR 40 SMD; Part Reference: TP7; Mfr_name: LOCAL; Mistral Part No: 130009030933; Project: RAINIER-3; Tolerance: NA; Value: TP40_SMD; PCB Footprint: TP40_SMD; Footprint Path: Y:\MIS_DATABASE\Library\ALTIUM_TOOL\PCB_FOOTPRINTS\Altium_Footprint_Lib.PcbLib; Library Path: Y:\MIS_DATABASE\Library\ALTIUM_TOOL\SCHEMATICS_PARTS\MS_DISCRETE_Library.schlib; Chkd/date: MAZHAR/190505; Crtd /date: MAZHAR/190505; Height: NA; Distributor_part_number: NA; Distributor_name: NA; Package: SMD; Part_type: TESTPOINT; Mfr_part_number: TP40_SMD; Voltage: NA; Wattage: NA; Weight: NA; Temperature: NA; Datasheet: NA; MECHANICAL 3D STEP FILE: NA; Library Ref: TESTPOINT; Footprint Ref: TP40_SMD; RoHS: NA
TP8 = TESTPOINT_Dup1: TESTPOINT CIR 40 SMD; Part Reference: TP8; Mistral Part No: 130009030933; Mfr_name: LOCAL; MECHANICAL 3D STEP FILE: NA; Project: RAINIER-3; Value: TP40_SMD; PCB Footprint: TP40_SMD; RoHS: NA; Footprint Ref: TP40_SMD; Library Ref: TESTPOINT; Datasheet: NA; Temperature: NA; Weight: NA; Wattage: NA; Voltage: NA; Tolerance: NA; Mfr_part_number: TP40_SMD; Part_type: TESTPOINT; Package: SMD; Distributor_name: NA; Distributor_part_number: NA; Height: NA; Crtd /date: MAZHAR/190505; Chkd/date: MAZHAR/190505; Library Path: Y:\MIS_DATABASE\Library\ALTIUM_TOOL\SCHEMATICS_PARTS\MS_DISCRETE_Library.schlib; Footprint Path: Y:\MIS_DATABASE\Library\ALTIUM_TOOL\PCB_FOOTPRINTS\Altium_Footprint_Lib.PcbLib
TP9 = TESTPOINT_Dup1: TESTPOINT CIR 40 SMD; Part Reference: TP9; Mfr_name: LOCAL; Mistral Part No: 130009030933; Project: RAINIER-3; Tolerance: NA; Value: TP40_SMD; PCB Footprint: TP40_SMD; Footprint Path: Y:\MIS_DATABASE\Library\ALTIUM_TOOL\PCB_FOOTPRINTS\Altium_Footprint_Lib.PcbLib; Library Path: Y:\MIS_DATABASE\Library\ALTIUM_TOOL\SCHEMATICS_PARTS\MS_DISCRETE_Library.schlib; Chkd/date: MAZHAR/190505; Crtd /date: MAZHAR/190505; Height: NA; Distributor_part_number: NA; Distributor_name: NA; Package: SMD; Part_type: TESTPOINT; Mfr_part_number: TP40_SMD; Voltage: NA; Wattage: NA; Weight: NA; Temperature: NA; Datasheet: NA; MECHANICAL 3D STEP FILE: NA; Library Ref: TESTPOINT; Footprint Ref: TP40_SMD; RoHS: NA
U65 = TCA9543APWR_TSSOP14: IC 2-CHANNEL I2C BUS SWITCH WITH RESET TSSOP14; Part Reference: U65; Part_type: ICS\DIGITAL\BUSTRANSCEIVER; Mfr_name: TEXAS INSTRUMENTS; Mistral Part No: 141016030006-R; Wattage: NA; Project: OCTASIC_3600; Value: TCA9543APWR; Chkd/date: VASANTHA/060516; Crtd /date: VASANTHA/070316; Datasheet: Y:\MIS_DATABASE\DATASHEETS\ICS\DIGITAL\BUSTRANSCEIVER\TCA9543A.PDF; Temperature: -40°C+85°C; Weight: NA; Height: 1.20MM; Library Ref: TCA9543APWR_TSSOP14; Distributor_part_number: 296-42157-1-ND; Distributor_name: DIGIKEY; Package: TSSOP14; Voltage: NA; Tolerance: NA; Mfr_part_number: TCA9543APWR; PCB Footprint: TSSOP14_25-59_205X180